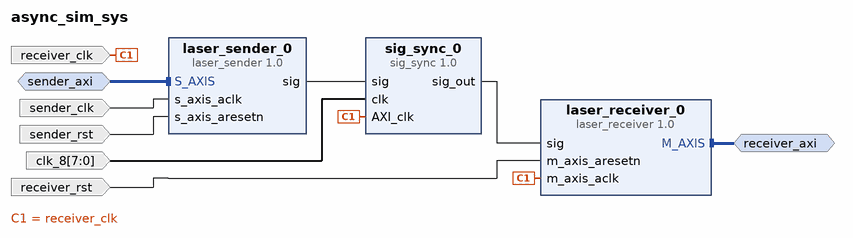
[diagram p0: block diagram of the top level]
# Vivado block design async_sim_sys, xc7z010clg400-1, Vivado 2019.1
create_bd_design async_sim_sys

create_bd_intf_port -mode Master -vlnv xilinx.com:interface:axis_rtl:1.0 receiver_axi
create_bd_intf_port -mode Slave -vlnv xilinx.com:interface:axis_rtl:1.0 sender_axi
set_property -dict [list \
  CONFIG.HAS_TKEEP 1 \
  CONFIG.HAS_TLAST 1 \
  CONFIG.HAS_TREADY 1 \
  CONFIG.HAS_TSTRB 0 \
  CONFIG.LAYERED_METADATA undef \
  CONFIG.TDATA_NUM_BYTES 1 \
  CONFIG.TDEST_WIDTH 0 \
  CONFIG.TID_WIDTH 0 \
  CONFIG.TUSER_WIDTH 0 \
] [get_bd_intf_ports sender_axi]
create_bd_port -dir I -from 7 -to 0 -type clk clk_8
create_bd_port -dir I -type clk sender_clk
set_property -dict {CONFIG.ASSOCIATED_RESET sender_rst:sender_rst} [get_bd_ports sender_clk]
create_bd_port -dir I -type clk receiver_clk
create_bd_port -dir I -type rst sender_rst
set_property -dict {CONFIG.POLARITY ACTIVE_LOW} [get_bd_ports sender_rst]
create_bd_port -dir I -type rst receiver_rst

create_bd_cell -type ip -vlnv xilinx.com:user:laser_sender:1.0 laser_sender_0
create_bd_cell -type ip -vlnv xilinx.com:user:laser_receiver:1.0 laser_receiver_0
create_bd_cell -type ip -vlnv xilinx.com:user:sig_sync:1.0 sig_sync_0

# ---- connections ----

connect_bd_intf_net -intf_net S_AXIS_0_1 [get_bd_intf_ports sender_axi] [get_bd_intf_pins laser_sender_0/S_AXIS]
connect_bd_intf_net [get_bd_intf_ports receiver_axi] [get_bd_intf_pins laser_receiver_0/M_AXIS]
connect_bd_net -net clk_0_1 [get_bd_ports clk_8] [get_bd_pins sig_sync_0/clk]
connect_bd_net [get_bd_pins laser_sender_0/sig] [get_bd_pins sig_sync_0/sig]
connect_bd_net [get_bd_pins sig_sync_0/sig_out] [get_bd_pins laser_receiver_0/sig]
connect_bd_net -net s_axis_aclk_0_1 [get_bd_ports sender_clk] [get_bd_pins laser_sender_0/s_axis_aclk]
connect_bd_net -net AXI_clk_0_1 [get_bd_ports receiver_clk] [get_bd_pins laser_receiver_0/m_axis_aclk] [get_bd_pins sig_sync_0/AXI_clk]
connect_bd_net -net s_axis_aresetn_0_1 [get_bd_ports sender_rst] [get_bd_pins laser_sender_0/s_axis_aresetn]
connect_bd_net -net m_axis_aresetn_0_1 [get_bd_ports receiver_rst] [get_bd_pins laser_receiver_0/m_axis_aresetn]

validate_bd_design
save_bd_design
